# Altium schematic sheet Input Sensors.SchDoc
size A4
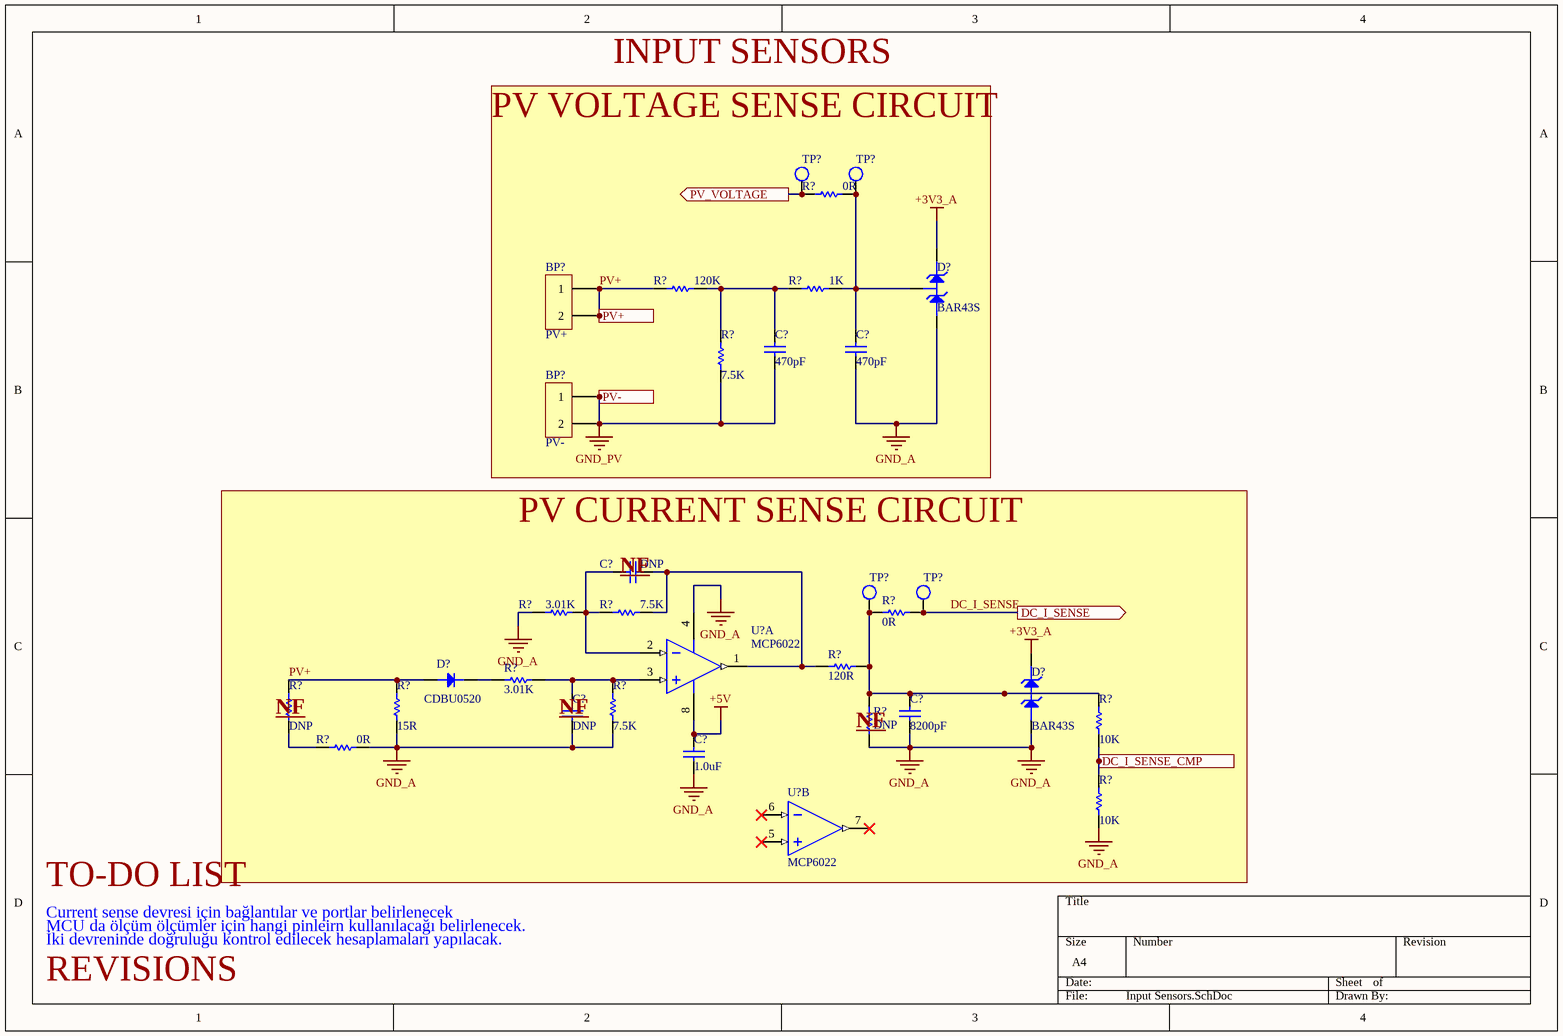
[diagram p0: Input Sensors.SchDoc]

## Parts
(Parts that share a designator on the sheet are numbered #1, #2 ... from top to bottom, then left to right.)
BP?#1  PV+
BP?#2  PV-
C?#1  470pF  [1206 CAPACITOR]
C?#2  470pF  [1206 CAPACITOR]
C?#3  DNP  [1206 CAPACITOR]
C?#4  DNP  [1206 CAPACITOR]
C?#5  8200pF  [1206 CAPACITOR]
C?#6  1.0uF  [1206 CAPACITOR]
D?#1  BAR43S  [SOT23-3]
D?#2  CDBU0520  [SOT-523F]
D?#3  BAR43S  [SOT23-3]
R?#1  0R  [1206 Resistor Footprint]
R?#2  120K  [1206 Resistor Footprint]
R?#3  1K  [1206 Resistor Footprint]
R?#4  7.5K  [1206 Resistor Footprint]
R?#5  3.01K  [1206 Resistor Footprint]
R?#6  7.5K  [1206 Resistor Footprint]
R?#7  0R  [1206 Resistor Footprint]
R?#8  120R  [1206 Resistor Footprint]
R?#9  3.01K  [1206 Resistor Footprint]
R?#10  DNP  [1206 Resistor Footprint]
R?#11  15R  [1206 Resistor Footprint]
R?#12  7.5K  [1206 Resistor Footprint]
R?#13  DNP  [1206 Resistor Footprint]
R?#14  10K  [1206 Resistor Footprint]
R?#15  0R  [1206 Resistor Footprint]
R?#16  10K  [1206 Resistor Footprint]
TP?#1  Test Point  [Test Point]  (value not drawn)
TP?#2  Test Point  [Test Point]  (value not drawn)
TP?#3  Test Point  [Test Point]  (value not drawn)
TP?#4  Test Point  [Test Point]  (value not drawn)
U?#1  MCP6022  [SOIC-SN8_M]  (part A of 2)
U?#2  MCP6022  [SOIC-SN8_M]  (part B of 2)

## Blocks framed on the sheet
PV CURRENT SENSE CIRCUIT: C?#3-C?#6 D?#2 D?#3 R?#5-R?#16 TP?#3 TP?#4 U?#1 U?#2

## Ports
DC_I_SENSE (out), DC_I_SENSE_CMP (out), PV+, PV-, PV_VOLTAGE (out)

## Nets
+3V3_A: D?#1.2 D?#3.2
+5V: C?#6.2 U?#1.8
GND_A: C?#2.1 C?#4.1 C?#5.1 C?#6.1 D?#1.1 D?#3.1 R?#5.1 R?#11.1 R?#12.1 R?#13.1 R?#15.2 R?#16.1 U?#1.4
GND_PV: BP?#2.1 BP?#2.2 C?#1.1 R?#4.1 ; port PV-
DC_I_SENSE: R?#7.1 TP?#4.1 ; port DC_I_SENSE
DC_I_SENSE_CMP: R?#14.1 R?#16.2 ; port DC_I_SENSE_CMP
PV+: BP?#1.1 BP?#1.2 D?#2.A R?#2.1 R?#10.1 R?#11.2 ; port PV+
PV_VOLTAGE: R?#1.1 TP?#1.1 ; port PV_VOLTAGE
NetC?#1_2: C?#1.2 R?#2.2 R?#3.1 R?#4.2
NetC?#2_2: C?#2.2 D?#1.3 R?#1.2 R?#3.2 TP?#2.1
NetC?#3_1: C?#3.1 R?#6.2 R?#8.2 U?#1.1(VOUTA)
NetC?#3_2: C?#3.2 R?#5.2 R?#6.1 U?#1.2(VINA-)
NetC?#4_2: C?#4.2 R?#9.1 R?#12.2 U?#1.3(VINA+)
NetC?#5_2: C?#5.2 D?#3.3 R?#7.2 R?#8.1 R?#13.2 R?#14.2 TP?#3.1
NetD?#2_K: D?#2.K R?#9.2
NetR?#10_2: R?#10.2 R?#15.1

Not connected (* = marked no-connect by the designer): U?#2 5(VINB+)* 6(VINB-)* 7(VOUTB)*

## Notes on the sheet
- INPUT SENSORS
- PV VOLTAGE SENSE CIRCUIT
- (near C?#3) NF
- (near R?#10) NF
- (near C?#4) NF
- (near R?#13) NF
- TO-DO LIST
- Current sense devresi için bağlantılar ve portlar belirlenecek
- REVISIONS
- MCU da ölçüm ölçümler için hangi pinleirn kullanılacağı belirlenecek.
- İki devreninde doğruluğu kontrol edilecek hesaplamaları yapılacak.

## Library data of the parts
BP?#1 BP?#2 = TE Conn 63824-1: CONN QC TAB 0.250 SOLDER; Manufacturer: TE Connectivity; Body Material: Brass; Plating: Tin; Gender: Male; Insulation: Non-Insulated; Mating Tab Width: 0.25inch; Hole Diameter: 0.055inch; PCB Thickness: 0.062inch; Tab Width: 6.35mm; Tab Thickness: 0.83mm; Supplier 1: Arrow; Manufacturer Part Number: 63824-1; RoHS: Yes; Category: Headers and Wire Housings; Stock 1: 2670000; Pricing 1: 10000=0.03800, 20000=0.03520, 30000=0.03230, 50000=0.03040, 10000=0.03920, 20000=0.03630, 30000=0.03330, 50000=0.03140 (USD); Mount: Through Hole; Contact Plating: Tin; Color: Silver; Contact Material: Brass; Material: Brass; Body Plating: Tin; Terminal Material: Brass; Min Operating Temperature: -30°C; Max Operating Temperature: 110°C; Packaging: Tape and Reel; Package Quantity: 10000; Termination: Tab; Orientation: Straight; Length: 13.63mm; Height: 14.02mm; Depth: 7.92mm; Radiation Hardening: No; Lead Free: Lead Free; REACH SVHC: Unknown; ELV: Compliant; ComponentLink1URL: https://datasheet.ciiva.com/19463/853927-19463156.pdf?src-supplier=Jameco; ComponentLink1Description: https://datasheet.ciiva.com/19463/853927-19463156.pdf?src-supplier=Jameco; ComponentLink2URL: https://datasheet.ciiva.com/11721/0900766b80ddd72b-11721738.pdf?src-supplier=RSComponents; ComponentLink2Description: https://datasheet.ciiva.com/11721/0900766b80ddd72b-11721738.pdf?src-supplier=RSComponents; ComponentLink3URL: https://datasheet.ciiva.com/16672/eng-cs-82004-faston-pcb-tabs-receptacles-0914-16672135.pdf?src-supplier=Avnet+Europe; ComponentLink3Description: https://datasheet.ciiva.com/16672/eng-cs-82004-faston-pcb-tabs-receptacles-0914-16672135.pdf?src-supplier=Avnet+Europe; ComponentLink4URL: https://datasheet.ciiva.com/46393/1650963-46393511.pdf?src-supplier=Element14; ComponentLink4Description: https://datasheet.ciiva.com/46393/1650963-46393511.pdf?src-supplier=Element14; ComponentLink5URL: https://datasheet.ciiva.com/839/eng-cd-63824-r-basefilename-839115.pdf?src-supplier=Digi-Key; ComponentLink5Description: https://datasheet.ciiva.com/839/eng-cd-63824-r-basefilename-839115.pdf?src-supplier=Digi-Key; ComponentLink6URL: https://datasheet.ciiva.com/7873/1650963-7873563.pdf?src-supplier=Element14; ComponentLink6Description: https://datasheet.ciiva.com/7873/1650963-7873563.pdf?src-supplier=Element14; ComponentLink7URL: https://datasheet.ciiva.com/3144/eng-cs-82004-faston-pcb-tabs-receptacles-0914-3144076.pdf?src-supplier=Avnet; ComponentLink7Description: https://datasheet.ciiva.com/3144/eng-cs-82004-faston-pcb-tabs-receptacles-0914-3144076.pdf?src-supplier=Avnet; ComponentLink8URL: https://datasheet.ciiva.com/15168/getdatasheetpartid-110188-15168813.pdf?src-supplier=Verical; ComponentLink8Description: https://datasheet.ciiva.com/15168/getdatasheetpartid-110188-15168813.pdf?src-supplier=Verical; ComponentLink9URL: https://datasheet.ciiva.com/16494/eng-cs-82004-faston-pcb-tabs-receptacles-0914-16494590.pdf?src-supplier=Avnet+Asia; ComponentLink9Description: https://datasheet.ciiva.com/16494/eng-cs-82004-faston-pcb-tabs-receptacles-0914-16494590.pdf?src-supplier=Avnet+Asia; Supplier Part Number 1: 63824-1
C?#1-C?#6 = Capacitor Non-Polorized: Value: 10uF; Case-EIA: 1206; Tolerance: -20% to +80%; Rated Voltage: 25 V; Case-Metric: 3216; Max Thickness: 1.9 mm; Technology: SMT
D?#1 D?#3 = Schottky Rectifier
D?#2 = Diode
R?#1-R?#16 = Resistor
U?#1 U?#2 = Op-Amp: PackageDescription: 8-Lead Plastic Small Outline (SN) - Narrow, 3.90mm Body [SOIC]; ComponentLink2Description: Datasheet; ComponentLink3Description: Package Specification; Code_JEDEC: MS-012; RevisionNote: URLs added.; DatasheetVersion: revD, Feb-2009; Code_IPC: SOIC127P600-8; ComponentLink3URL: http://www.microchip.com/stellent/groups/techpub_sg/documents/packagingspec/en012702.pdf; PackageReference: SOIC-SN8; PackageVersion: revBB, Aug-2009; ComponentLink2URL: http://ww1.microchip.com/downloads/en/DeviceDoc/21685d.pdf; ComponentLink1URL: http://www.microchip.com/; ComponentLink1Description: Manufacturer URL